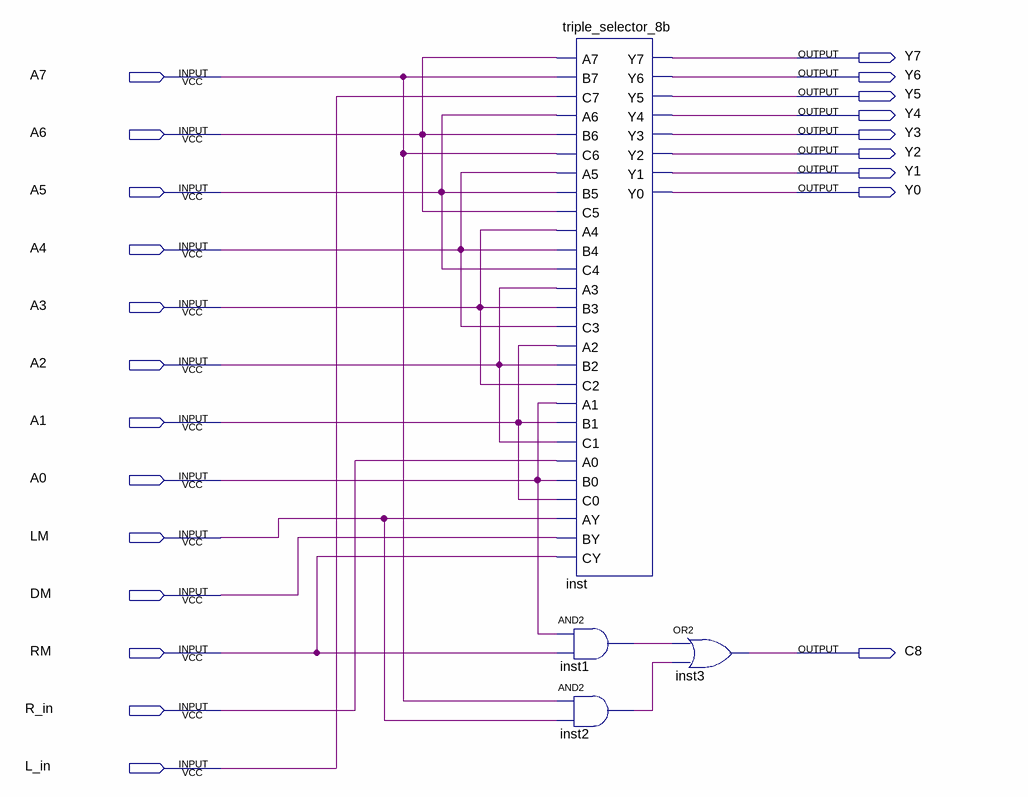
[diagram p0: schematic sheet]
// Quartus schematic shifter_8b.bdf as structural Verilog: 4 symbols, 22 pins
module shifter_8b (
  input  A7,
  input  A6,
  input  A5,
  input  A4,
  input  A3,
  input  A2,
  input  A1,
  input  A0,
  input  LM,
  input  DM,
  input  RM,
  input  R_in,
  input  L_in,
  output Y7,
  output Y6,
  output Y5,
  output Y4,
  output Y3,
  output Y2,
  output Y1,
  output Y0,
  output C8
);

  wire inst1_out, inst2_out;

  triple_selector_8b inst (
    .A7(A6), .B7(A7), .C7(L_in), .A6(A5), .B6(A6), .C6(A7), .A5(A4), .B5(A5), .C5(A6), .A4(A3), .B4(A4),
    .C4(A5), .A3(A2), .B3(A3), .C3(A4), .A2(A1), .B2(A2), .C2(A3), .A1(A0), .B1(A1), .C1(A2), .A0(R_in),
    .B0(A0), .C0(A1), .AY(LM), .BY(DM), .CY(RM), .Y7(Y7), .Y6(Y6), .Y5(Y5), .Y4(Y4), .Y3(Y3), .Y2(Y2),
    .Y1(Y1), .Y0(Y0));
  and inst1 (inst1_out, A0, RM);
  and inst2 (inst2_out, A7, LM);
  or inst3 (C8, inst1_out, inst2_out);
endmodule
